# EasyEDA Pro project MN42_v2.eprj, schematic MOAR_Schematic

## Sheets
1 INTERFACE/LED/MIDI/CNTRL: Board Name: MOAR; Create Date: 2025-07-18; Page Name: INTERFACE/LED/MIDI/CNTRL; Project Name: MN42_v2; Schematic Name: MOAR_Schematic; Update Date: 2025-08-01; File: btnBRD; Id: /; Sheet: /
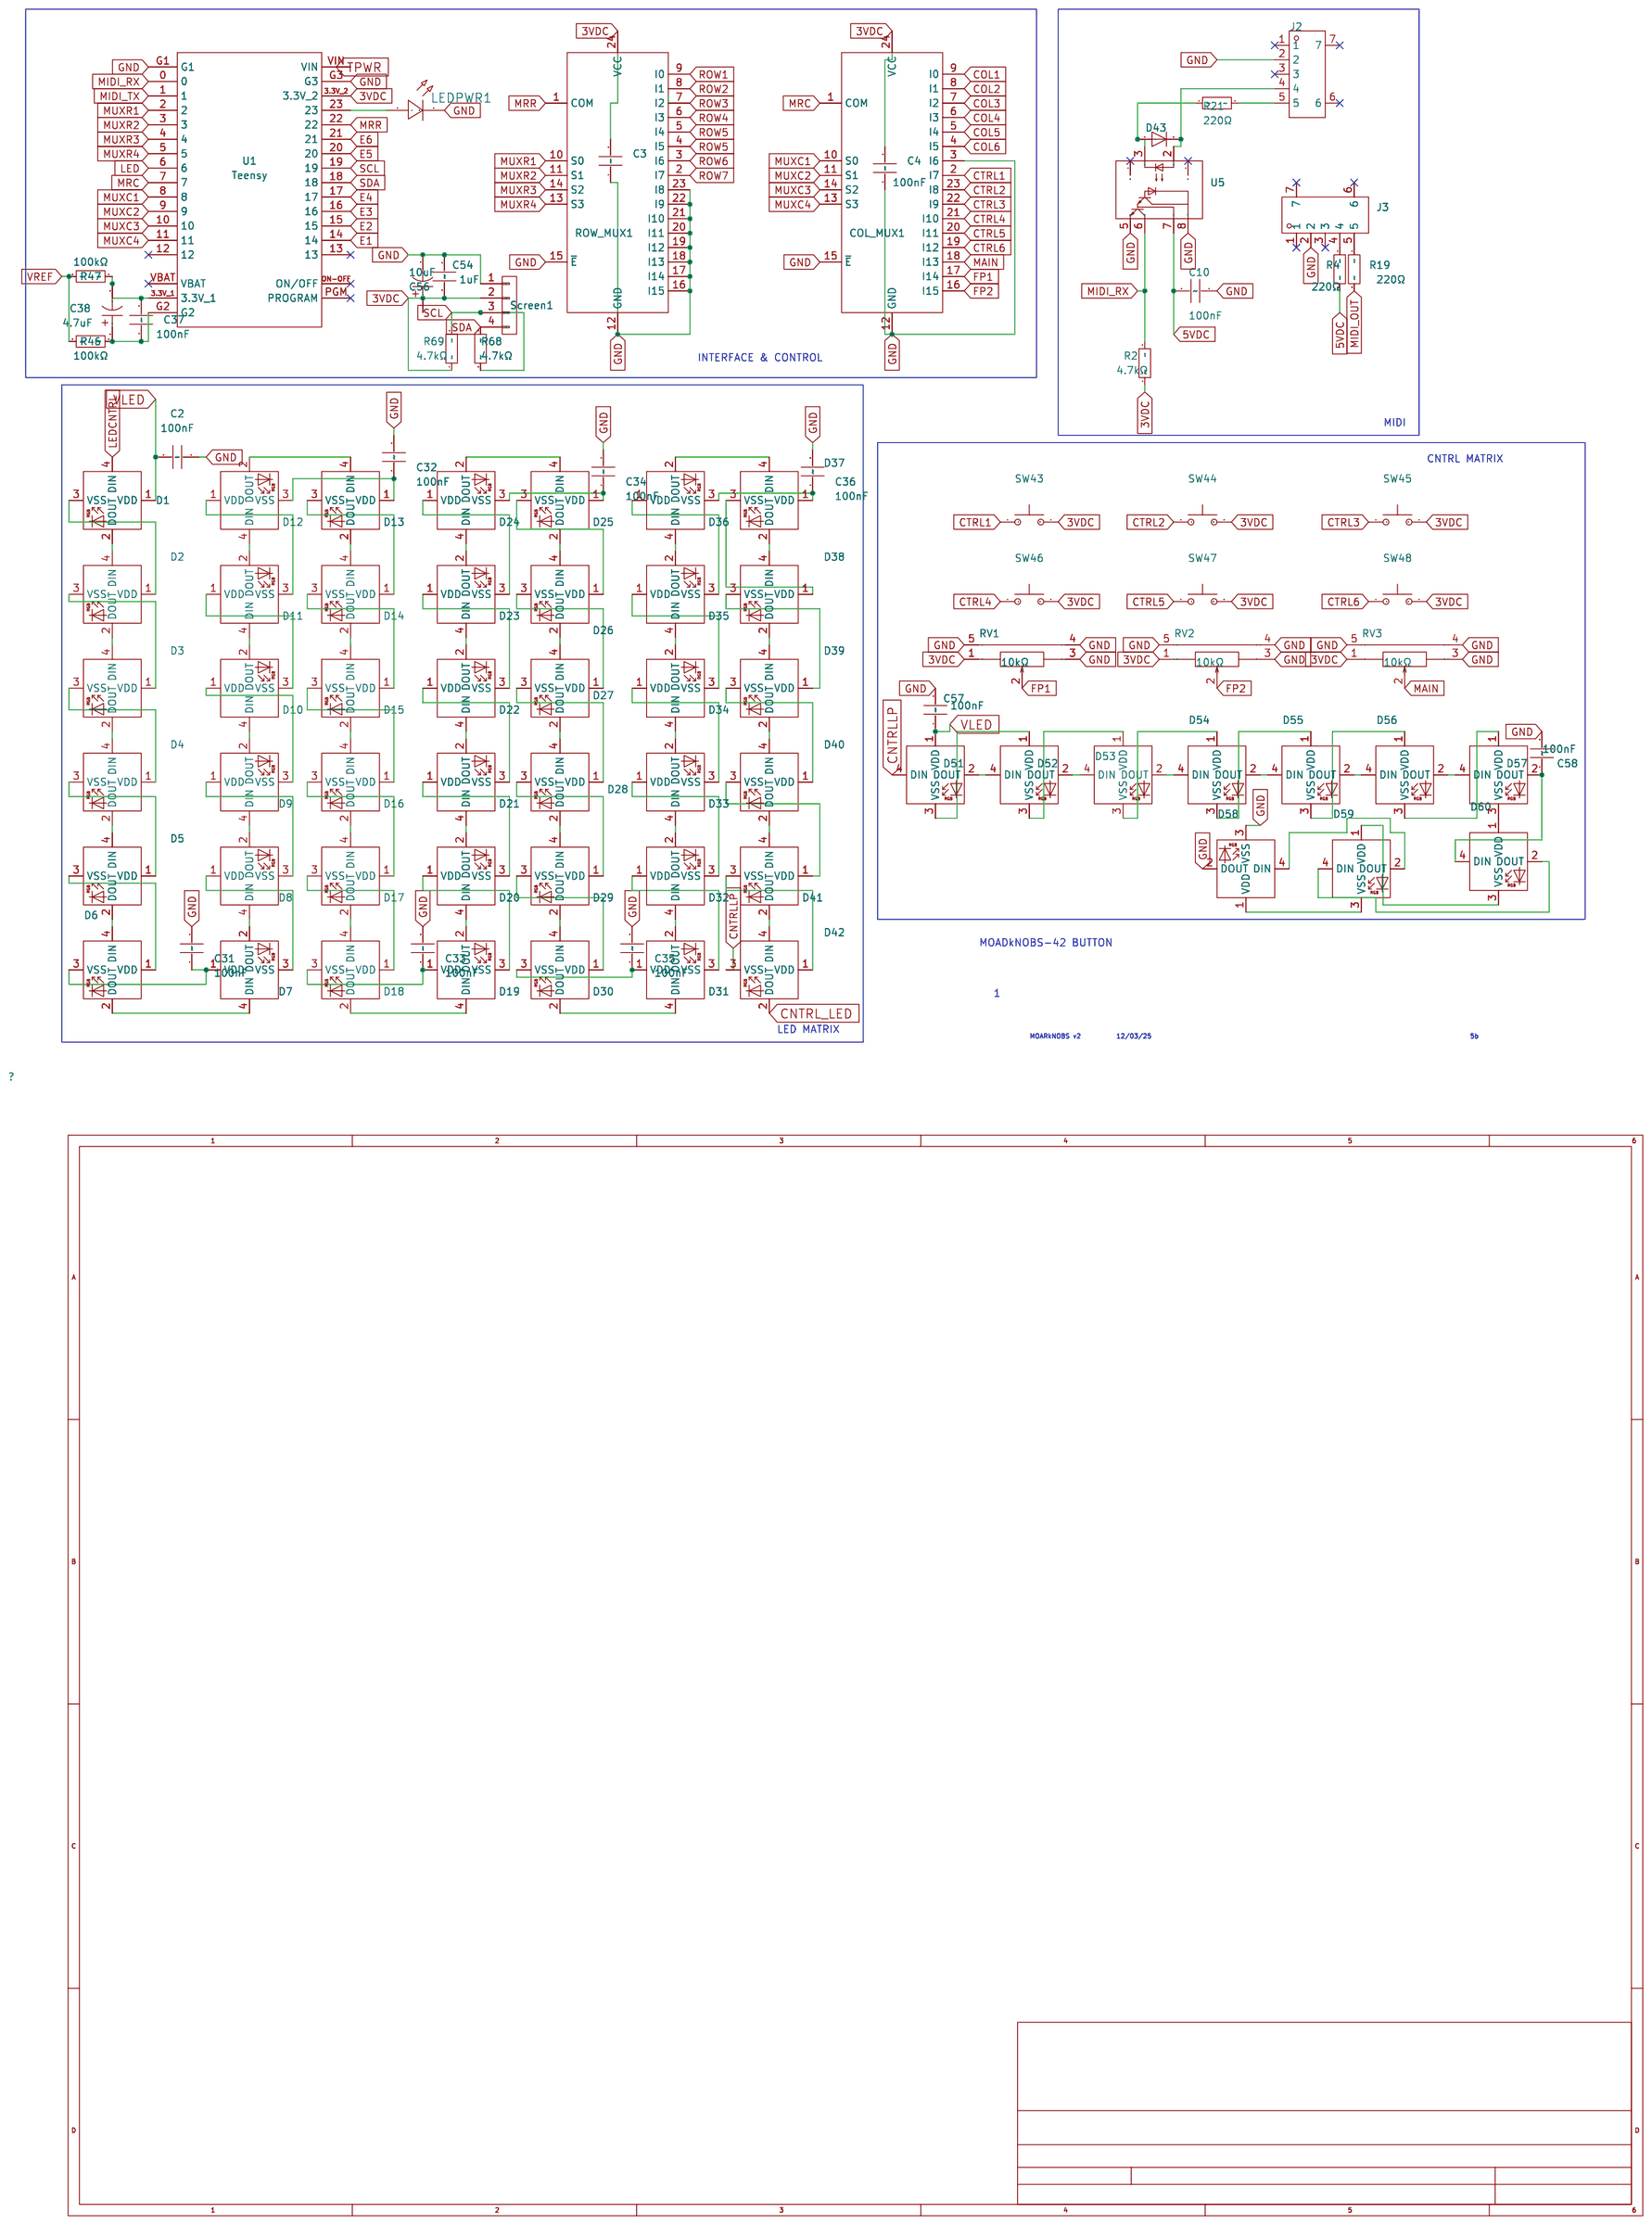
[diagram p0: INTERFACE/LED/MIDI/CNTRL]
2 ENVELOPE: Create Date: 2025-07-19; Page Name: ENVELOPE; Update Date: 2025-07-29; Company: EasyEDA.com; Page Size: A4; Version: V1.0
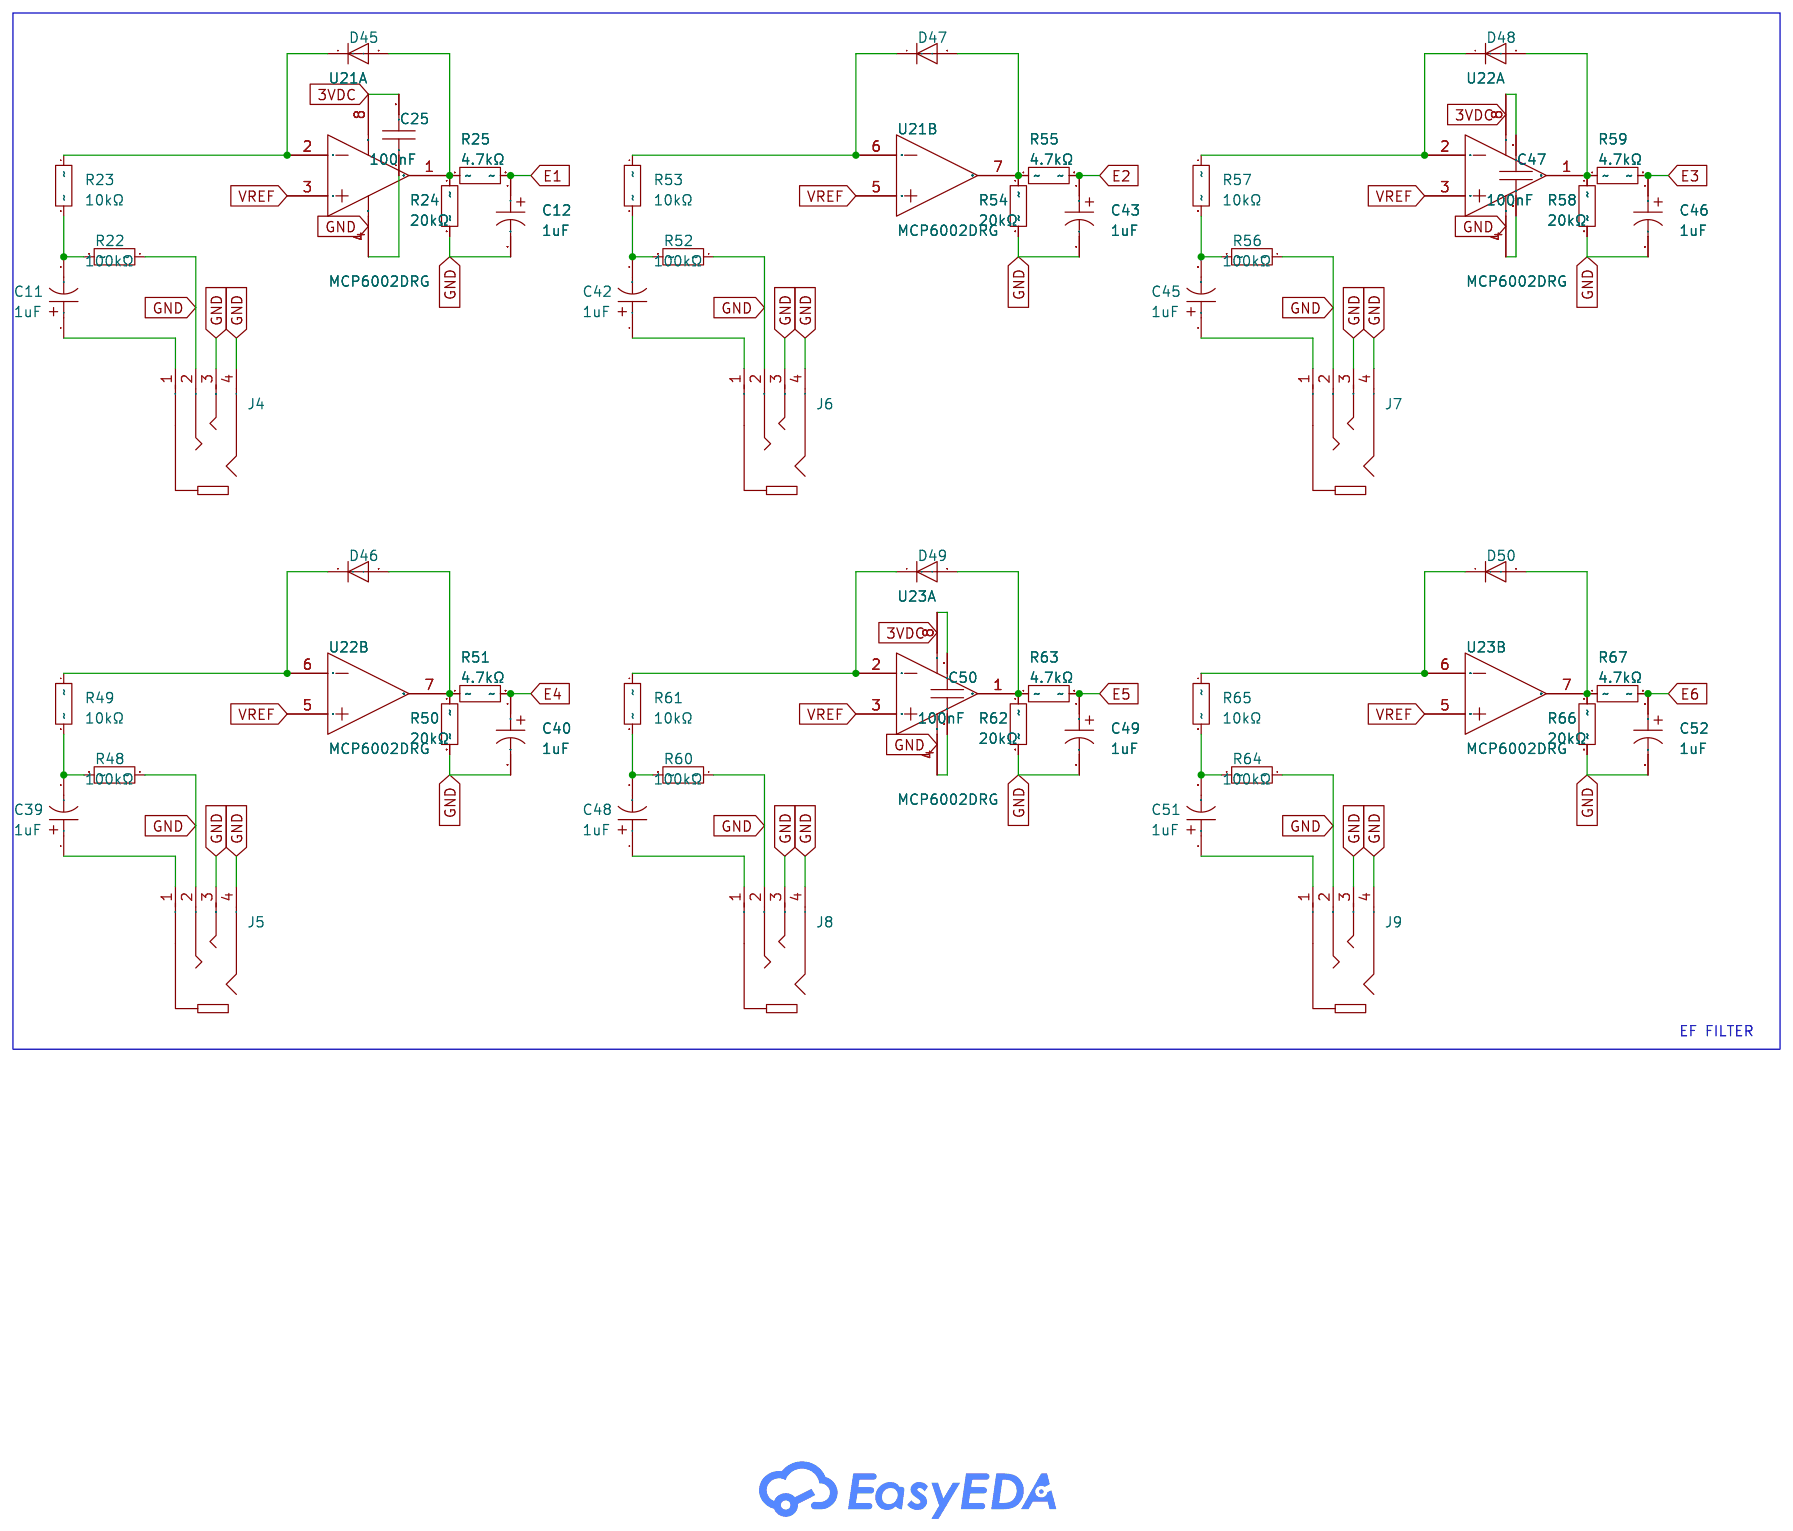
[diagram p1: ENVELOPE]
3 PWR/BUTTON/TEST: Board Name: btnBRD; Create Date: 2025-07-19; Page Name: P3; Schematic Name: btnBRD; Update Date: 2025-07-21; Company: EasyEDA.com; Page Size: A4; Version: V1.0
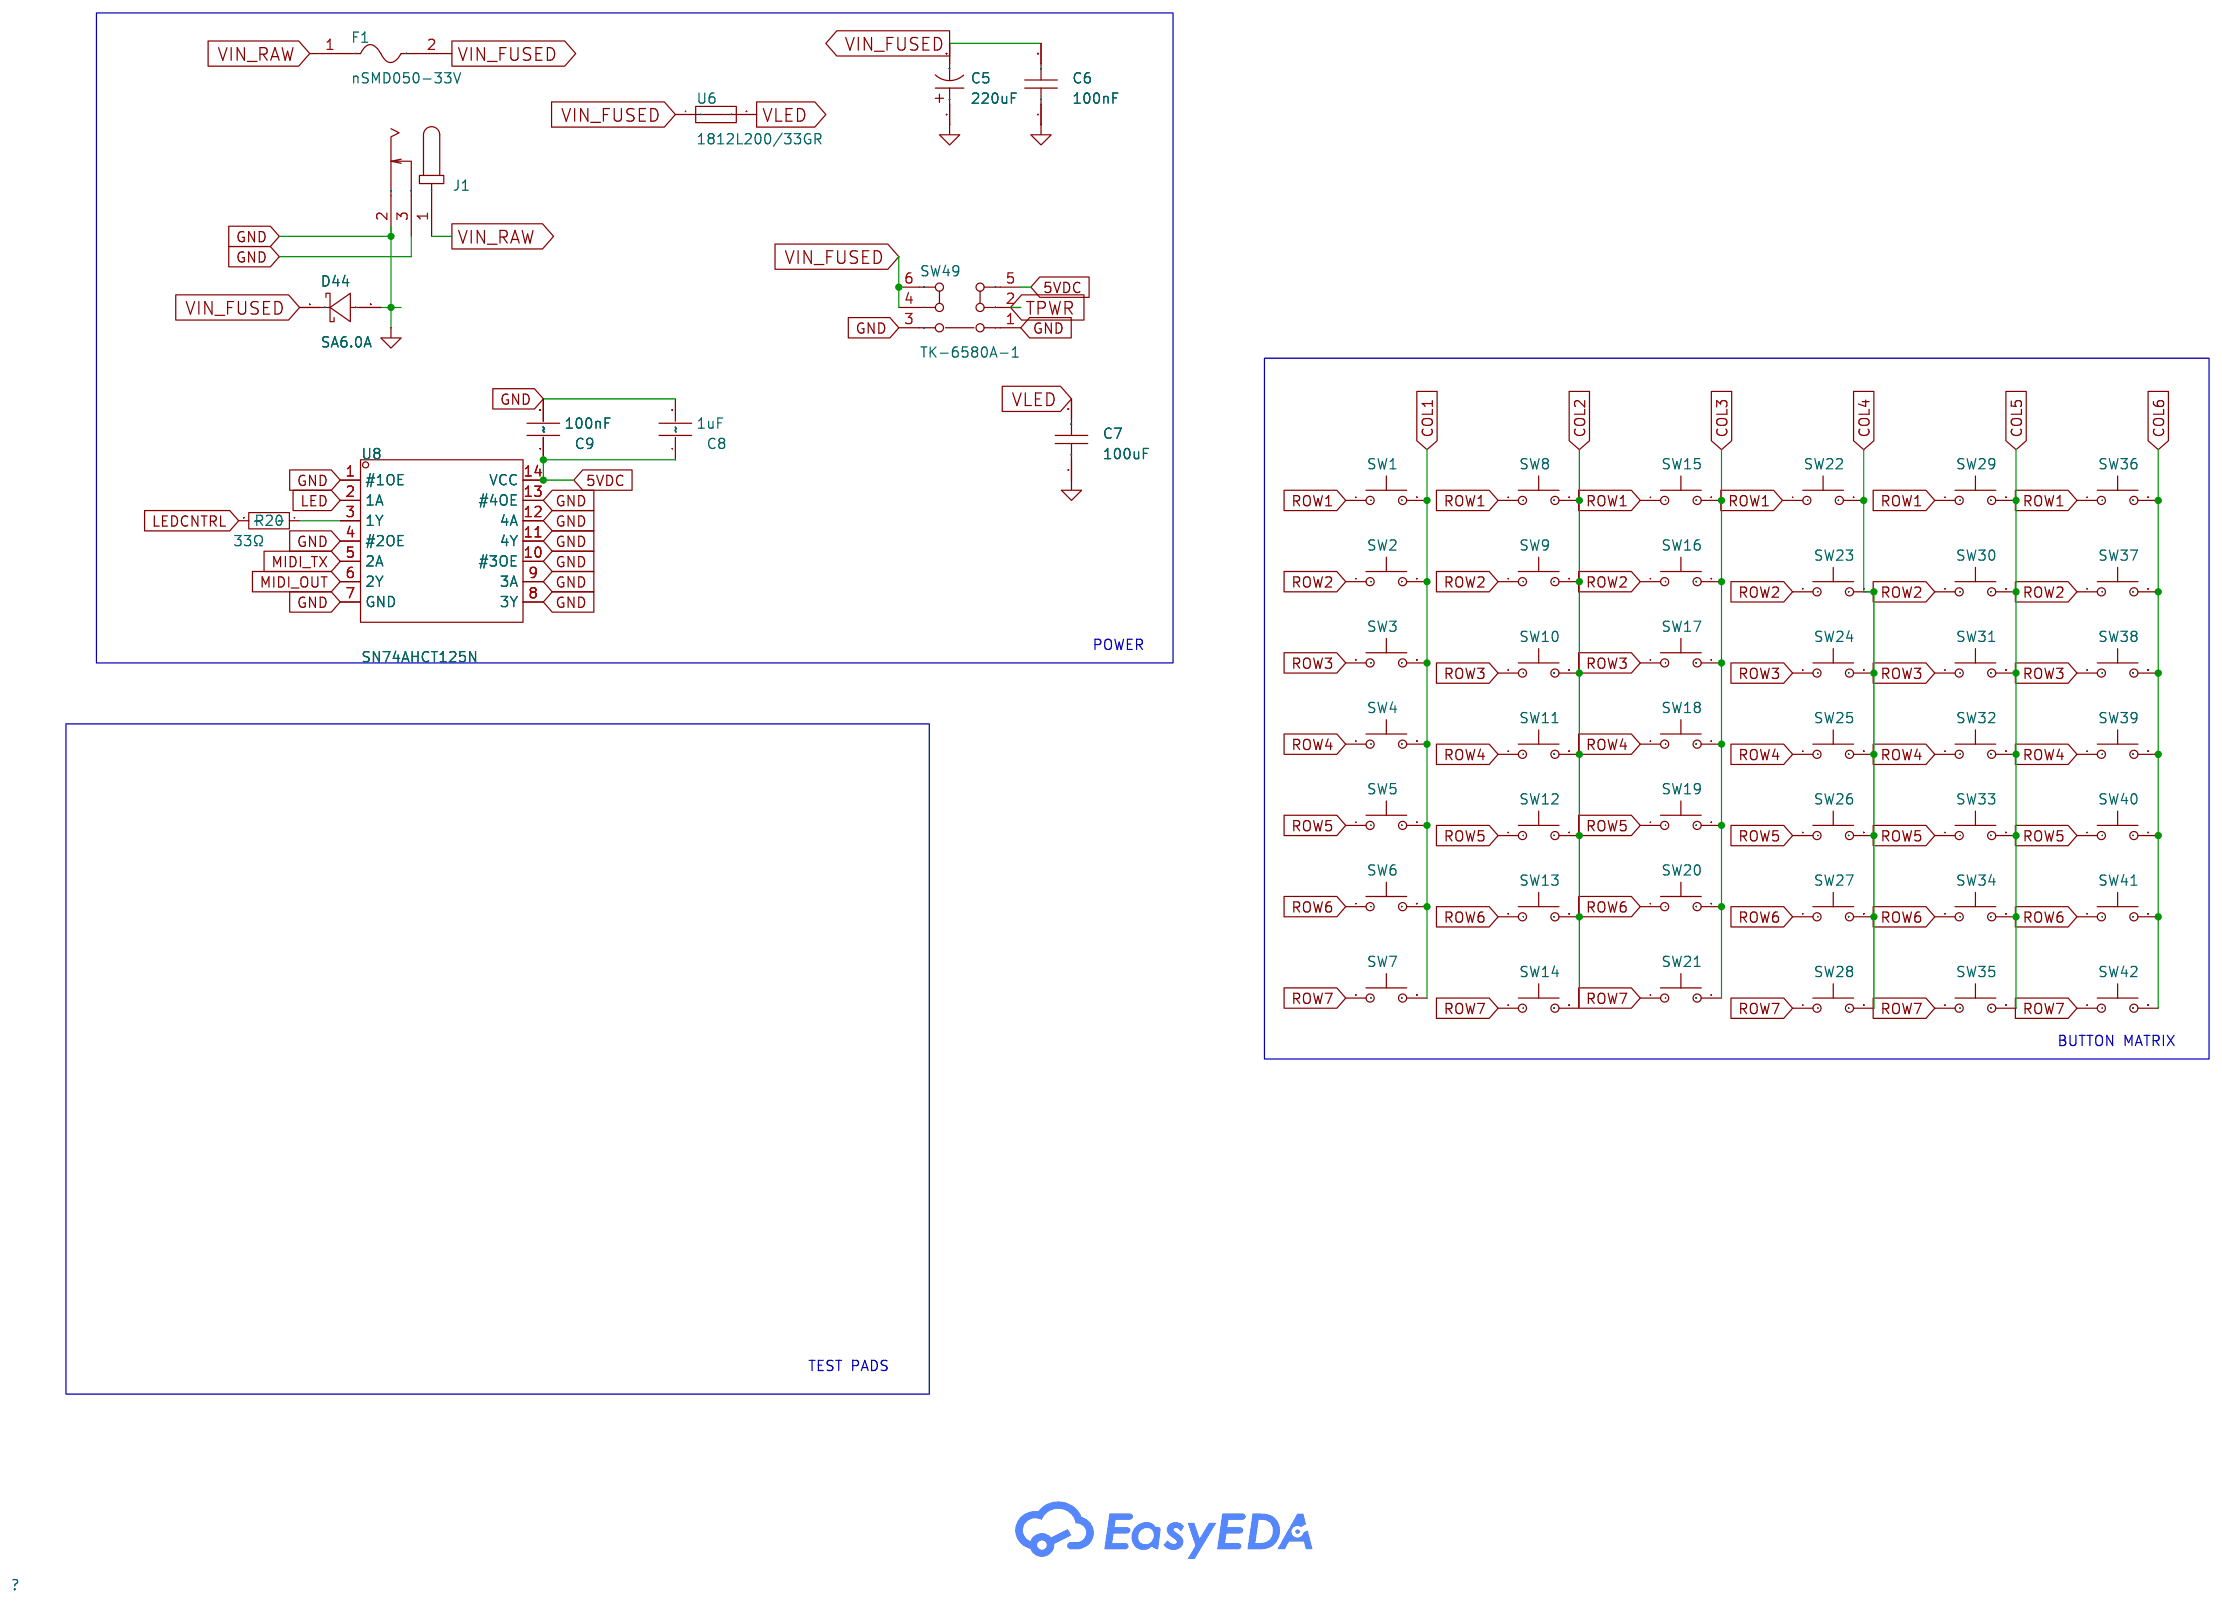
[diagram p2: PWR/BUTTON/TEST]

## Parts
sheet ENVELOPE
C11  1uF  [CAP-SMD_BD6.3-L6.6-W6.6-FD]
C12  1uF  [CAP-SMD_BD6.3-L6.6-W6.6-FD]
C25  100nF  [CAP-TH_L5.0-W2.5-P5.00-D1.0]
C39  1uF  [CAP-SMD_BD6.3-L6.6-W6.6-FD]
C40  1uF  [CAP-SMD_BD6.3-L6.6-W6.6-FD]
C42  1uF  [CAP-SMD_BD6.3-L6.6-W6.6-FD]
C43  1uF  [CAP-SMD_BD6.3-L6.6-W6.6-FD]
C45  1uF  [CAP-SMD_BD6.3-L6.6-W6.6-FD]
C46  1uF  [CAP-SMD_BD6.3-L6.6-W6.6-FD]
C47  100nF  [CAP-TH_L5.0-W2.5-P5.00-D1.0]
C48  1uF  [CAP-SMD_BD6.3-L6.6-W6.6-FD]
C49  1uF  [CAP-SMD_BD6.3-L6.6-W6.6-FD]
C50  100nF  [CAP-TH_L5.0-W2.5-P5.00-D1.0]
C51  1uF  [CAP-SMD_BD6.3-L6.6-W6.6-FD]
C52  1uF  [CAP-SMD_BD6.3-L6.6-W6.6-FD]
D45  1N4148PF  [DO-35_BD1.9-L3.9-P7.90-D0.5-FD]
D46  1N4148PF  [DO-35_BD1.9-L3.9-P7.90-D0.5-FD]
D47  1N4148PF  [DO-35_BD1.9-L3.9-P7.90-D0.5-FD]
D48  1N4148PF  [DO-35_BD1.9-L3.9-P7.90-D0.5-FD]
D49  1N4148PF  [DO-35_BD1.9-L3.9-P7.90-D0.5-FD]
D50  1N4148PF  [DO-35_BD1.9-L3.9-P7.90-D0.5-FD]
J4  HC-PJ-320A  [AUDIO-SMD_HC-PJ-320A]
J5  HC-PJ-320A  [AUDIO-SMD_HC-PJ-320A]
J6  HC-PJ-320A  [AUDIO-SMD_HC-PJ-320A]
J7  HC-PJ-320A  [AUDIO-SMD_HC-PJ-320A]
J8  HC-PJ-320A  [AUDIO-SMD_HC-PJ-320A]
J9  HC-PJ-320A  [AUDIO-SMD_HC-PJ-320A]
R22  100kΩ  [RES-TH_BD1.7-L3.5-P7.50-D0.5]
R23  10kΩ  [RES-TH_BD1.7-L3.5-P7.50-D0.5]
R24  20kΩ  [RES-TH_BD1.7-L3.5-P7.50-D0.5]
R25  4.7kΩ  [RES-TH_BD1.7-L3.5-P7.50-D0.5]
R48  100kΩ  [RES-TH_BD1.7-L3.5-P7.50-D0.5]
R49  10kΩ  [RES-TH_BD1.7-L3.5-P7.50-D0.5]
R50  20kΩ  [RES-TH_BD1.7-L3.5-P7.50-D0.5]
R51  4.7kΩ  [RES-TH_BD1.7-L3.5-P7.50-D0.5]
R52  100kΩ  [RES-TH_BD1.7-L3.5-P7.50-D0.5]
R53  10kΩ  [RES-TH_BD1.7-L3.5-P7.50-D0.5]
R54  20kΩ  [RES-TH_BD1.7-L3.5-P7.50-D0.5]
R55  4.7kΩ  [RES-TH_BD1.7-L3.5-P7.50-D0.5]
R56  100kΩ  [RES-TH_BD1.7-L3.5-P7.50-D0.5]
R57  10kΩ  [RES-TH_BD1.7-L3.5-P7.50-D0.5]
R58  20kΩ  [RES-TH_BD1.7-L3.5-P7.50-D0.5]
R59  4.7kΩ  [RES-TH_BD1.7-L3.5-P7.50-D0.5]
R60  100kΩ  [RES-TH_BD1.7-L3.5-P7.50-D0.5]
R61  10kΩ  [RES-TH_BD1.7-L3.5-P7.50-D0.5]
R62  20kΩ  [RES-TH_BD1.7-L3.5-P7.50-D0.5]
R63  4.7kΩ  [RES-TH_BD1.7-L3.5-P7.50-D0.5]
R64  100kΩ  [RES-TH_BD1.7-L3.5-P7.50-D0.5]
R65  10kΩ  [RES-TH_BD1.7-L3.5-P7.50-D0.5]
R66  20kΩ  [RES-TH_BD1.7-L3.5-P7.50-D0.5]
R67  4.7kΩ  [RES-TH_BD1.7-L3.5-P7.50-D0.5]
U21  MCP6002DRG  [SOP-8_L4.9-W3.9-P1.27-LS6.0-BL]  (sections 1,2)
U22  MCP6002DRG  [SOP-8_L4.9-W3.9-P1.27-LS6.0-BL]  (sections 1,2)
U23  MCP6002DRG  [SOP-8_L4.9-W3.9-P1.27-LS6.0-BL]  (sections 1,2)
sheet INTERFACE/LED/MIDI/CNTRL
C2  100nF  [CAP-TH_L5.0-W4.0-P5.00-D1.0]
C3  100nF  [CAP-TH_L5.0-W4.0-P5.00-D1.0]
C4  100nF  [CAP-TH_L5.0-W4.0-P5.00-D1.0]
C10  100nF  [CAP-TH_L5.0-W4.0-P5.00-D1.0]
C31  100nF  [CAP-TH_L5.0-W4.0-P5.00-D1.0]
C32  100nF  [CAP-TH_L5.0-W4.0-P5.00-D1.0]
C33  100nF  [CAP-TH_L5.0-W4.0-P5.00-D1.0]
C34  100nF  [CAP-TH_L5.0-W4.0-P5.00-D1.0]
C35  100nF  [CAP-TH_L5.0-W4.0-P5.00-D1.0]
C36  100nF  [CAP-TH_L5.0-W4.0-P5.00-D1.0]
C37  100nF  [CAP-TH_L5.0-W4.0-P5.00-D1.0]
C38  4.7uF  [CAP-SMD_BD6.3-L6.6-W6.6-FD]
C54  1uF  [CAP-TH_L5.0-W4.0-P5.00-D1.0]
C56  10uF  [CAP-SMD_BD6.3-L6.6-W6.6-FD]
C57  100nF  [CAP-TH_L5.0-W4.0-P5.00-D1.0]
C58  100nF  [CAP-TH_L5.0-W4.0-P5.00-D1.0]
COL_MUX1  CD74HC4067M96  [SOIC-24_L15.4-W7.5-P1.27-LS10.3-BL]
D1  XL-5050RGBC-WS2812B  [LED-SMD_4P-L5.0-W5.0-BL_XL-5050RGBC]
D2  XL-5050RGBC-WS2812B  [LED-SMD_4P-L5.0-W5.0-BL_XL-5050RGBC]
D3  XL-5050RGBC-WS2812B  [LED-SMD_4P-L5.0-W5.0-BL_XL-5050RGBC]
D4  XL-5050RGBC-WS2812B  [LED-SMD_4P-L5.0-W5.0-BL_XL-5050RGBC]
D5  XL-5050RGBC-WS2812B  [LED-SMD_4P-L5.0-W5.0-BL_XL-5050RGBC]
D6  XL-5050RGBC-WS2812B  [LED-SMD_4P-L5.0-W5.0-BL_XL-5050RGBC]
D7  XL-5050RGBC-WS2812B  [LED-SMD_4P-L5.0-W5.0-BL_XL-5050RGBC]
D8  XL-5050RGBC-WS2812B  [LED-SMD_4P-L5.0-W5.0-BL_XL-5050RGBC]
D9  XL-5050RGBC-WS2812B  [LED-SMD_4P-L5.0-W5.0-BL_XL-5050RGBC]
D10  XL-5050RGBC-WS2812B  [LED-SMD_4P-L5.0-W5.0-BL_XL-5050RGBC]
D11  XL-5050RGBC-WS2812B  [LED-SMD_4P-L5.0-W5.0-BL_XL-5050RGBC]
D12  XL-5050RGBC-WS2812B  [LED-SMD_4P-L5.0-W5.0-BL_XL-5050RGBC]
D13  XL-5050RGBC-WS2812B  [LED-SMD_4P-L5.0-W5.0-BL_XL-5050RGBC]
D14  XL-5050RGBC-WS2812B  [LED-SMD_4P-L5.0-W5.0-BL_XL-5050RGBC]
D15  XL-5050RGBC-WS2812B  [LED-SMD_4P-L5.0-W5.0-BL_XL-5050RGBC]
D16  XL-5050RGBC-WS2812B  [LED-SMD_4P-L5.0-W5.0-BL_XL-5050RGBC]
D17  XL-5050RGBC-WS2812B  [LED-SMD_4P-L5.0-W5.0-BL_XL-5050RGBC]
D18  XL-5050RGBC-WS2812B  [LED-SMD_4P-L5.0-W5.0-BL_XL-5050RGBC]
D19  XL-5050RGBC-WS2812B  [LED-SMD_4P-L5.0-W5.0-BL_XL-5050RGBC]
D20  XL-5050RGBC-WS2812B  [LED-SMD_4P-L5.0-W5.0-BL_XL-5050RGBC]
D21  XL-5050RGBC-WS2812B  [LED-SMD_4P-L5.0-W5.0-BL_XL-5050RGBC]
D22  XL-5050RGBC-WS2812B  [LED-SMD_4P-L5.0-W5.0-BL_XL-5050RGBC]
D23  XL-5050RGBC-WS2812B  [LED-SMD_4P-L5.0-W5.0-BL_XL-5050RGBC]
D24  XL-5050RGBC-WS2812B  [LED-SMD_4P-L5.0-W5.0-BL_XL-5050RGBC]
D25  XL-5050RGBC-WS2812B  [LED-SMD_4P-L5.0-W5.0-BL_XL-5050RGBC]
D26  XL-5050RGBC-WS2812B  [LED-SMD_4P-L5.0-W5.0-BL_XL-5050RGBC]
D27  XL-5050RGBC-WS2812B  [LED-SMD_4P-L5.0-W5.0-BL_XL-5050RGBC]
D28  XL-5050RGBC-WS2812B  [LED-SMD_4P-L5.0-W5.0-BL_XL-5050RGBC]
D29  XL-5050RGBC-WS2812B  [LED-SMD_4P-L5.0-W5.0-BL_XL-5050RGBC]
D30  XL-5050RGBC-WS2812B  [LED-SMD_4P-L5.0-W5.0-BL_XL-5050RGBC]
D31  XL-5050RGBC-WS2812B  [LED-SMD_4P-L5.0-W5.0-BL_XL-5050RGBC]
D32  XL-5050RGBC-WS2812B  [LED-SMD_4P-L5.0-W5.0-BL_XL-5050RGBC]
D33  XL-5050RGBC-WS2812B  [LED-SMD_4P-L5.0-W5.0-BL_XL-5050RGBC]
D34  XL-5050RGBC-WS2812B  [LED-SMD_4P-L5.0-W5.0-BL_XL-5050RGBC]
D35  XL-5050RGBC-WS2812B  [LED-SMD_4P-L5.0-W5.0-BL_XL-5050RGBC]
D36  XL-5050RGBC-WS2812B  [LED-SMD_4P-L5.0-W5.0-BL_XL-5050RGBC]
D37  XL-5050RGBC-WS2812B  [LED-SMD_4P-L5.0-W5.0-BL_XL-5050RGBC]
D38  XL-5050RGBC-WS2812B  [LED-SMD_4P-L5.0-W5.0-BL_XL-5050RGBC]
D39  XL-5050RGBC-WS2812B  [LED-SMD_4P-L5.0-W5.0-BL_XL-5050RGBC]
D40  XL-5050RGBC-WS2812B  [LED-SMD_4P-L5.0-W5.0-BL_XL-5050RGBC]
D41  XL-5050RGBC-WS2812B  [LED-SMD_4P-L5.0-W5.0-BL_XL-5050RGBC]
D42  XL-5050RGBC-WS2812B  [LED-SMD_4P-L5.0-W5.0-BL_XL-5050RGBC]
D43  1N4148PF  [DO-35_BD1.9-L3.9-P7.90-D0.5-FD]
D51  XL-5050RGBC-WS2812B  [LED-SMD_4P-L5.0-W5.0-BL_XL-5050RGBC]
D52  XL-5050RGBC-WS2812B  [LED-SMD_4P-L5.0-W5.0-BL_XL-5050RGBC]
D53  XL-5050RGBC-WS2812B  [LED-SMD_4P-L5.0-W5.0-BL_XL-5050RGBC]
D54  XL-5050RGBC-WS2812B  [LED-SMD_4P-L5.0-W5.0-BL_XL-5050RGBC]
D55  XL-5050RGBC-WS2812B  [LED-SMD_4P-L5.0-W5.0-BL_XL-5050RGBC]
D56  XL-5050RGBC-WS2812B  [LED-SMD_4P-L5.0-W5.0-BL_XL-5050RGBC]
D57  XL-5050RGBC-WS2812B  [LED-SMD_4P-L5.0-W5.0-BL_XL-5050RGBC]
D58  XL-5050RGBC-WS2812B  [LED-SMD_4P-L5.0-W5.0-BL_XL-5050RGBC]
D59  XL-5050RGBC-WS2812B  [LED-SMD_4P-L5.0-W5.0-BL_XL-5050RGBC]
D60  XL-5050RGBC-WS2812B  [LED-SMD_4P-L5.0-W5.0-BL_XL-5050RGBC]
J2  DIN-504B-M10  [CONN-TH_DIN-504B-M10]
J3  DIN-504B-M10  [CONN-TH_DIN-504B-M10]
LEDPWR1  -  [LED_0603]
R2  4.7kΩ  [RES-TH_BD1.7-L3.5-P7.50-D0.5]
R4  220Ω  [RES-TH_BD1.7-L3.5-P7.50-D0.5]
R19  220Ω  [RES-TH_BD1.7-L3.5-P7.50-D0.5]
R21  220Ω  [RES-TH_BD1.7-L3.5-P7.50-D0.5]
R46  100kΩ  [RES-TH_BD1.7-L3.5-P7.50-D0.5]
R47  100kΩ  [RES-TH_BD1.7-L3.5-P7.50-D0.5]
R68  4.7kΩ  [RES-TH_BD1.7-L3.5-P7.50-D0.5]
R69  4.7kΩ  [RES-TH_BD1.7-L3.5-P7.50-D0.5]
ROW_MUX1  CD74HC4067M96  [SOIC-24_L15.4-W7.5-P1.27-LS10.3-BL]
RV1  10kΩ  [RES-ADJ-TH_RK09K1130A5R]
RV2  10kΩ  [RES-ADJ-TH_RK09K1130A5R]
RV3  10kΩ  [RES-ADJ-TH_RK09K1130A5R]
Screen1  HS96L03W2C03  [OLED-TH_L27.8-W27.2-P2.54_C9900033791]
SW43  HX B3F-4055-Y  [SW-TH_4P-L12.0-W12.0-P5.00-LS12.5]
SW44  HX B3F-4055-Y  [SW-TH_4P-L12.0-W12.0-P5.00-LS12.5]
SW45  HX B3F-4055-Y  [SW-TH_4P-L12.0-W12.0-P5.00-LS12.5]
SW46  HX B3F-4055-Y  [SW-TH_4P-L12.0-W12.0-P5.00-LS12.5]
SW47  HX B3F-4055-Y  [SW-TH_4P-L12.0-W12.0-P5.00-LS12.5]
SW48  HX B3F-4055-Y  [SW-TH_4P-L12.0-W12.0-P5.00-LS12.5]
U1  Teensy  [teensy 4.0:MODULE_DEV-15583]
U5  6N138  [DIP-8_L9.8-W6.6-P2.54-LS7.6-BL]
sheet PWR/BUTTON/TEST
C5  220uF  [CAP-SMD_BD6.3-L6.6-W6.6-FD]
C6  100nF  [CAP-TH_L5.0-W2.5-P5.00-D1.0]
C7  100uF  [C1206]
C8  1uF  [CAP-TH_L5.0-W4.0-P5.00-D1.0]
C9  100nF  [CAP-TH_L5.0-W4.0-P5.00-D1.0]
D44  SA6.0A  [DO-15_BD3.1-L6.7-P10.70-D0.8-RD]
F1  nSMD050-33V  [F1206]
J1  DC005  [DC-IN-TH_DC005]
R20  33Ω  [RES-TH_BD1.7-L3.5-P7.50-D0.5]
SW1  HX B3F-4055-Y  [SW-TH_4P-L12.0-W12.0-P5.00-LS12.5]
SW2  HX B3F-4055-Y  [SW-TH_4P-L12.0-W12.0-P5.00-LS12.5]
SW3  HX B3F-4055-Y  [SW-TH_4P-L12.0-W12.0-P5.00-LS12.5]
SW4  HX B3F-4055-Y  [SW-TH_4P-L12.0-W12.0-P5.00-LS12.5]
SW5  HX B3F-4055-Y  [SW-TH_4P-L12.0-W12.0-P5.00-LS12.5]
SW6  HX B3F-4055-Y  [SW-TH_4P-L12.0-W12.0-P5.00-LS12.5]
SW7  HX B3F-4055-Y  [SW-TH_4P-L12.0-W12.0-P5.00-LS12.5]
SW8  HX B3F-4055-Y  [SW-TH_4P-L12.0-W12.0-P5.00-LS12.5]
SW9  HX B3F-4055-Y  [SW-TH_4P-L12.0-W12.0-P5.00-LS12.5]
SW10  HX B3F-4055-Y  [SW-TH_4P-L12.0-W12.0-P5.00-LS12.5]
SW11  HX B3F-4055-Y  [SW-TH_4P-L12.0-W12.0-P5.00-LS12.5]
SW12  HX B3F-4055-Y  [SW-TH_4P-L12.0-W12.0-P5.00-LS12.5]
SW13  HX B3F-4055-Y  [SW-TH_4P-L12.0-W12.0-P5.00-LS12.5]
SW14  HX B3F-4055-Y  [SW-TH_4P-L12.0-W12.0-P5.00-LS12.5]
SW15  HX B3F-4055-Y  [SW-TH_4P-L12.0-W12.0-P5.00-LS12.5]
SW16  HX B3F-4055-Y  [SW-TH_4P-L12.0-W12.0-P5.00-LS12.5]
SW17  HX B3F-4055-Y  [SW-TH_4P-L12.0-W12.0-P5.00-LS12.5]
SW18  HX B3F-4055-Y  [SW-TH_4P-L12.0-W12.0-P5.00-LS12.5]
SW19  HX B3F-4055-Y  [SW-TH_4P-L12.0-W12.0-P5.00-LS12.5]
SW20  HX B3F-4055-Y  [SW-TH_4P-L12.0-W12.0-P5.00-LS12.5]
SW21  HX B3F-4055-Y  [SW-TH_4P-L12.0-W12.0-P5.00-LS12.5]
SW22  HX B3F-4055-Y  [SW-TH_4P-L12.0-W12.0-P5.00-LS12.5]
SW23  HX B3F-4055-Y  [SW-TH_4P-L12.0-W12.0-P5.00-LS12.5]
SW24  HX B3F-4055-Y  [SW-TH_4P-L12.0-W12.0-P5.00-LS12.5]
SW25  HX B3F-4055-Y  [SW-TH_4P-L12.0-W12.0-P5.00-LS12.5]
SW26  HX B3F-4055-Y  [SW-TH_4P-L12.0-W12.0-P5.00-LS12.5]
SW27  HX B3F-4055-Y  [SW-TH_4P-L12.0-W12.0-P5.00-LS12.5]
SW28  HX B3F-4055-Y  [SW-TH_4P-L12.0-W12.0-P5.00-LS12.5]
SW29  HX B3F-4055-Y  [SW-TH_4P-L12.0-W12.0-P5.00-LS12.5]
SW30  HX B3F-4055-Y  [SW-TH_4P-L12.0-W12.0-P5.00-LS12.5]
SW31  HX B3F-4055-Y  [SW-TH_4P-L12.0-W12.0-P5.00-LS12.5]
SW32  HX B3F-4055-Y  [SW-TH_4P-L12.0-W12.0-P5.00-LS12.5]
SW33  HX B3F-4055-Y  [SW-TH_4P-L12.0-W12.0-P5.00-LS12.5]
SW34  HX B3F-4055-Y  [SW-TH_4P-L12.0-W12.0-P5.00-LS12.5]
SW35  HX B3F-4055-Y  [SW-TH_4P-L12.0-W12.0-P5.00-LS12.5]
SW36  HX B3F-4055-Y  [SW-TH_4P-L12.0-W12.0-P5.00-LS12.5]
SW37  HX B3F-4055-Y  [SW-TH_4P-L12.0-W12.0-P5.00-LS12.5]
SW38  HX B3F-4055-Y  [SW-TH_4P-L12.0-W12.0-P5.00-LS12.5]
SW39  HX B3F-4055-Y  [SW-TH_4P-L12.0-W12.0-P5.00-LS12.5]
SW40  HX B3F-4055-Y  [SW-TH_4P-L12.0-W12.0-P5.00-LS12.5]
SW41  HX B3F-4055-Y  [SW-TH_4P-L12.0-W12.0-P5.00-LS12.5]
SW42  HX B3F-4055-Y  [SW-TH_4P-L12.0-W12.0-P5.00-LS12.5]
SW49  TK-6580A-1  [SW-TH_TK-6580A-1]
U6  1812L200/33GR  [F1812]
U8  SN74AHCT125N  [PDIP-14_L19.3-W6.4-P2.54-LS7.6-BL]

## Library data of the parts
C5 C11 C12 C38-C40 C42 C43 C45 C46 C48 C49 C51 C52 C56 = 189RV0019: Capacitance:220uF Tolerance:±20% Tolerance:±20% Voltage Rating:35V Ripple Current:600mA@100KHz Equivalent Series Resistance(ESR):160mΩ@100KHz Diameter:6.3mm Height - Seated (Max):7.7mm Lifetime:2000hrs@105℃ Operating Temperature:-55℃~+105℃ Operating Tempe; LCSC Part Name: 220uF ±20% 35V; Supplier Part: C7471881; Manufacturer: KNSCHA(科尼盛); Supplier Footprint: SMD,D6.3xL7.7mm; JLCPCB Part Class: Extended Part; Datasheet: https://atta.szlcsc.com/upload/public/pdf/source/20230907/E1EFA38CB5E88857ECE494F7E9D8FBCC.pdf; Supplier: LCSC; Tolerance: ±20%; Voltage Rating: 35V; Ripple Current: 600mA@100KHz; Equivalent Series Resistance(ESR): 160mΩ@100KHz; Diameter: 6.3mm; Height - Seated (Max): 7.7mm; Lifetime: 2000hrs@105℃; Operating Temperature: -55℃~+105℃
C6 C25 C47 C50 = CC1H104MC1FD3F6C10MF: Capacitance:100nF Tolerance:±20% Tolerance:±20% Voltage Rating:50V Pin Spacing:5.08mm Temperature Coefficient:Y5V Diameter:6mm Body Thickness:2.2mm; LCSC Part Name: 100nF ±20% 50V; Supplier Part: C254085; Manufacturer: Dersonic(德尔创); Supplier Footprint: 插件,P=5.08mm; JLCPCB Part Class: Extended Part; Datasheet: https://atta.szlcsc.com/upload/public/pdf/source/20200826/C254085_159DD65BF32BF11C9168D341BCE23E6F.pdf; Supplier: LCSC; Tolerance: ±20%; Voltage Rating: 50V; Pin Spacing: 5.08mm; Temperature Coefficient: Y5V; Diameter: 6mm; Body Thickness: 2.2mm
D43 D45-D50 = 1N4148PF: Supplier Part: C2992430; Manufacturer: ST(先科); Supplier Footprint: DO-35; JLCPCB Part Class: Extended Part; Datasheet: https://atta.szlcsc.com/upload/public/pdf/source/20220414/133B43E450E13E2641A7D12D66654211.pdf; Supplier: LCSC
J4-J9 = HC-PJ-320A: Connector Type:3.5mm Headphone Jack Current Rating:500mA Voltage Rating (Max):30V Contact Material:Copper Contact Plating:Nickel Operating Temperature:-25℃~+70℃ Operating Temperature:-25℃~+70℃; LCSC Part Name: 黑色 3.5mm耳机座 PJ-320A 插件黑色; Supplier Part: C7501806; Manufacturer: HC(虹成电子); Supplier Footprint: 插件; JLCPCB Part Class: Extended Part; Datasheet: https://atta.szlcsc.com/upload/public/pdf/source/20250106/7D33987A36C8C755DD3F52F3C7FA5722.pdf; Supplier: LCSC; Connector Type: 3.5mm Headphone Jack; Current Rating: 500mA; Voltage Rating (Max): 30V; Contact Material: Copper; Contact Plating: Nickel; Operating Temperature: -25℃~+70℃
R2 R22-R25 R48-R69 = RN 1/8W 4K7 F T/B A1: Type:Metal Film Resistors Resistance: Tolerance:±1% Tolerance:±1% Overload Voltage (Max):150V Power(Watts):125mW Temperature Coefficient:±50ppm/℃ Temperature Coefficient:±50ppm/℃ Operating Temperature Range:-55℃~+125℃ Operating Temperature Range:-55℃~+125; LCSC Part Name: 4.7kΩ ±1% 125mW 金属膜电阻; Supplier Part: C433477; Manufacturer: Tyohm(幸亚电阻); Supplier Footprint: 插件,D1.7xL3.5mm; JLCPCB Part Class: Extended Part; Datasheet: https://atta.szlcsc.com/upload/public/pdf/source/20191008/C433681_B72693A7FD256E0D1DC5EFE3F095EED3.pdf; Supplier: LCSC; Type: Metal Film Resistors; Tolerance: ±1%; Overload Voltage (Max): 150V; Power(Watts): 125mW; Temperature Coefficient: ±50ppm/℃; Operating Temperature Range: -55℃~+125℃
U21-U23 = MCP6002DRG: LCSC Part Name: 带射频滤波器的1Mhz cmos轨到轨IO光放大器; Supplier Part: C5145244; Manufacturer: HGC(深圳汉芯); Supplier Footprint: SOP-8; JLCPCB Part Class: Extended Part; Datasheet: https://atta.szlcsc.com/upload/public/pdf/source/20240611/76E5A89C667E57E3492874B73CA75C44.pdf; Supplier: LCSC; Number of Circuits: Dual; Maximum Power Supply Range (Vdd-Vss): 6V; Rail to Rail: Rail-to-rail input, rail-to-rail output; Gain Bandwidth Product(GBP): 1MHz; Voltage - Input Offset(Vos): 3.5mV; Input Offset Voltage Drift (Vos TC): 2.7uV/℃; Slew Rate(SR): 0.8V/us; Noise density(eN): 20nV/√Hz@10kHz; Common Mode Rejection Ratio (CMRR): 68dB; Operating Temperature: -40℃~+125℃
C2-C4 C8-C10 C31-C37 C54 C57 C58 = CT4G-0805-2X1-63V-0.1μF-K: Capacitance:100nF Tolerance:±10% Tolerance:±10% Voltage Rating:63V Temperature Coefficient:-; LCSC Part Name: 100nF ±10% 63V; Supplier Part: C400087; Manufacturer: TORCH(火炬); Supplier Footprint: 插件,P=5.08mm; JLCPCB Part Class: Extended Part; Datasheet: https://atta.szlcsc.com/upload/public/pdf/source/20191118/C454433_59D9A4E5EF49F2CA9CCAEF3FF757A9ED.pdf; Supplier: LCSC; Tolerance: ±10%; Voltage Rating: 63V
COL_MUX1 ROW_MUX1 = CD74HC4067M96: Switch Circuit:- Number of Channels:16 Supply Voltage:2V~6V Supply Voltage:2V~6V Turn-on time:83ns On-State Resistance (Max):200Ω Turn-off time:83ns Operating Temperature:-55℃~+125℃ Operating Temperature:-55℃~+125℃; LCSC Part Name: 高速CMOS逻辑16通道模拟多路复用器/解复用器; Supplier Part: C496123; Manufacturer: TI(德州仪器); Supplier Footprint: SOIC-24-300mil; JLCPCB Part Class: Extended Part; Datasheet: https://www.ti.com/cn/lit/gpn/cd74hc4067; Supplier: LCSC; Number of Channels: 16; Supply Voltage: 2V~6V; Turn-on time: 83ns; On-State Resistance (Max): 200Ω; Turn-off time: 83ns; Operating Temperature: -55℃~+125℃
D1-D42 D51-D60 = XL-5050RGBC-WS2812B: Supplier Part: C2843785; Manufacturer: XINGLIGHT(成兴光); Supplier Footprint: SMD5050; JLCPCB Part Class: Extended Part; Datasheet: https://atta.szlcsc.com/upload/public/pdf/source/20240412/E1004CAA80592E31D08BFE019083806F.pdf; Supplier: LCSC
J2 J3 = DIN-504B-M10: Supplier Part: C2939346; Manufacturer: HOOYA(皓宇电子); Supplier Footprint: 插件; JLCPCB Part Class: Extended Part; Datasheet: https://atta.szlcsc.com/upload/public/pdf/source/20220120/ABB2570656C6359DBC61E5C1017AC323.pdf; Supplier: LCSC
LEDPWR1 = LED_0603-R: Supplier Footprint: 0603
R4 R19 R21 = RN 1/8W 220R F T/B A1: Type:Metal Film Resistors Resistance: Tolerance:±1% Tolerance:±1% Overload Voltage (Max):150V Power(Watts):125mW Temperature Coefficient:±50ppm/℃ Temperature Coefficient:±50ppm/℃ Operating Temperature Range:-55℃~+125℃ Operating Temperature Range:-55℃~+125; LCSC Part Name: 220Ω ±1% 125mW 金属膜电阻; Supplier Part: C433487; Manufacturer: Tyohm(幸亚电阻); Supplier Footprint: 插件,D1.7xL3.5mm; JLCPCB Part Class: Extended Part; Datasheet: https://atta.szlcsc.com/upload/public/pdf/source/20191008/C433681_B72693A7FD256E0D1DC5EFE3F095EED3.pdf; Supplier: LCSC; Type: Metal Film Resistors; Tolerance: ±1%; Overload Voltage (Max): 150V; Power(Watts): 125mW; Temperature Coefficient: ±50ppm/℃; Operating Temperature Range: -55℃~+125℃
R20 R46 R47 = RN1/8W10KFT/BA1: Type:Metal Film Resistors Resistance: Tolerance:±1% Tolerance:±1% Overload Voltage (Max):150V Power(Watts):125mW Temperature Coefficient:±50ppm/℃ Temperature Coefficient:±50ppm/℃ Operating Temperature Range:-55℃~+125℃ Operating Temperature Range:-55℃~+125; LCSC Part Name: 10kΩ ±1% 125mW 金属膜电阻; Supplier Part: C433502; Manufacturer: Tyohm(幸亚电阻); Supplier Footprint: 插件,D1.7xL3.5mm; JLCPCB Part Class: Extended Part; Datasheet: https://atta.szlcsc.com/upload/public/pdf/source/20191008/C433681_B72693A7FD256E0D1DC5EFE3F095EED3.pdf; Supplier: LCSC; Type: Metal Film Resistors; Tolerance: ±1%; Overload Voltage (Max): 150V; Power(Watts): 125mW; Temperature Coefficient: ±50ppm/℃; Operating Temperature Range: -55℃~+125℃
RV1-RV3 = RK09K1130A5R: Resistance: Tolerance:±20% Tolerance:±20%; LCSC Part Name: 10kΩ ±20%; Supplier Part: C209779; Manufacturer: ALPSALPINE(阿尔卑斯阿尔派); Supplier Footprint: 插件; JLCPCB Part Class: Extended Part; Datasheet: https://atta.szlcsc.com/upload/public/pdf/source/20180404/C209779_144B5EF41D1B8507FF4660D0445AF581.pdf; Supplier: LCSC; Tolerance: ±20%
Screen1 = HS96L03W2C03: Main Control Chip:SSD1315 Interface Type:I2C Size:0.96 Pixel Resolution:128x64 Operating Temperature:-40℃~+70℃ Operating Temperature:-40℃~+70℃; LCSC Part Name: 0.96寸OLED显示屏窄白光IIC; Supplier Part: C5248080; Manufacturer: HS(汉昇); JLCPCB Part Class: Extended Part; Datasheet: https://atta.szlcsc.com/upload/public/pdf/source/20230627/763D01F79A90007632F098068C7C8AD9.pdf; Supplier: LCSC; Main Control Chip: SSD1315; Interface Type: I2C; Size: 0.96; Pixel Resolution: 128x64; Operating Temperature: -40℃~+70℃
SW1-SW48 = HX B3F-4055-Y: Actuator Style:Square Plunger Operating Force:2.5N Mounting Type:Direct Insert Length:11.8mm Width:11.8mm Switch Height:7.3mm Strike Gundam:- Contact Current:50mA Voltage Rating:12V Actuator/Cap Color:Yellow With Lamp:None IP Rating:- Termination Style:PC; LCSC Part Name: 12*12*7.3mm 直插 轻触开关; Supplier Part: C36498965; Manufacturer: hanxia(韩下); Supplier Footprint: DIP,12x12mm; JLCPCB Part Class: Extended Part; Datasheet: https://atta.szlcsc.com/upload/public/pdf/source/20241121/FA8A3B5FC41001412F2E47168C08B6C2.pdf; Supplier: LCSC; Actuator Style: Square Plunger; Operating Force: 2.5N; Mounting Type: Direct Insert; Length: 11.8mm; Width: 11.8mm; Switch Height: 7.3mm; Contact Current: 50mA; Voltage Rating: 12V; Actuator/Cap Color: Yellow; With Lamp: None; Termination Style: PCPin; Life: 100,000 Times; Operating Temperature: -25℃~+85℃
U1 = teensy40_DEV-15583: STANDARD: Manufacturer Recommendations; MAXIMUM_PACKAGE_HEIGHT: 5.87mm; MANUFACTURER: Sparkfun
U5 = 6N138: Input Type:DC Supply Voltage:- Supply Voltage:- Isolation Voltage(rms):5kV Common Mode Transient Immunity (CMTI):1kV/us Number of Channels:1 Operating Temperature:-55℃~+85℃ Operating Temperature:-55℃~+85℃; LCSC Part Name: DC输入 1通道 隔离电压(rms):5000V; Supplier Part: C255743; Manufacturer: ISOCOM(英国安数光); Supplier Footprint: DIP-8; JLCPCB Part Class: Extended Part; Datasheet: https://atta.szlcsc.com/upload/public/pdf/source/20180822/C255747_0DE46B44EFBF5BF2F7E9C825E24779A2.pdf; Supplier: LCSC; Input Type: DC; Isolation Voltage(rms): 5kV; Common Mode Transient Immunity (CMTI): 1kV/us; Number of Channels: 1; Operating Temperature: -55℃~+85℃
C7 = HGC1206R5107M100NSPJ: Capacitance:100uF Tolerance:±20% Tolerance:±20% Voltage Rating:10V Temperature Coefficient:X5R; LCSC Part Name: 100uF ±20% 10V; Supplier Part: C7432784; Manufacturer: Chinocera(华瓷); Supplier Footprint: 1206; JLCPCB Part Class: Extended Part; Datasheet: https://atta.szlcsc.com/upload/public/pdf/source/20240320/FAC3FEC40A78BC5CCCE96C232A94D860.pdf; Supplier: LCSC; Tolerance: ±20%; Voltage Rating: 10V; Temperature Coefficient: X5R
D44 = SA6.0A: Reverse Stand-Off Voltage (Vrwm):6V Maximum Clamping Voltage:10.3V Peak Pulse Current (Ipp)@10/1000us:49.5A Peak Pulse Power Dissipation (Ppp)@10/1000us:500W Breakdown Voltage:6.67V Type:TVS; LCSC Part Name: TVS 6V截止 49.5A峰值脉冲; Supplier Part: C1973281; Manufacturer: Littelfuse(美国力特); Supplier Footprint: DO-15(DO-204AC); JLCPCB Part Class: Extended Part; Datasheet: https://atta.szlcsc.com/upload/public/pdf/source/20210601/0B3E4F854A384945BCD9F467CEEB89B0.pdf; Supplier: LCSC; Reverse Stand-Off Voltage (Vrwm): 6V; Maximum Clamping Voltage: 10.3V; Peak Pulse Current (Ipp)@10/1000us: 49.5A; Peak Pulse Power Dissipation (Ppp)@10/1000us: 500W; Breakdown Voltage: 6.67V; Type: TVS
F1 = nSMD050-33V: Voltage - Max:33V Current - Max:100A Hold Current:500mA Trip Current:1A; LCSC Part Name: 0.50A  33V 自恢复保险丝; Supplier Part: C70077; Manufacturer: 台湾陆海; Supplier Footprint: 1206; JLCPCB Part Class: Extended Part; Datasheet: https://atta.szlcsc.com/upload/public/pdf/source/20180608/C70077_B8D50CC58F6AC16481F48F7D0521DF66.pdf; Supplier: LCSC; Voltage - Max: 33V; Current - Max: 100A; Hold Current: 500mA; Trip Current: 1A
J1 = DC005: Connector Type:DC Power Receptacle Mounting Style:Bend-in Inside Contact Diameter:2mm Outside Contact Diameter:6.3mm Current Rating (Max):500mA Voltage Rating (Max):30V Operating Temperature Range:-25℃~+70℃ Operating Temperature Range:-25℃~+70℃; LCSC Part Name: DC电源插座 内径:2mm 外径:6.3mm; Supplier Part: C431533; Manufacturer: SHOU HAN(首韩); Supplier Footprint: 插件; JLCPCB Part Class: Extended Part; Datasheet: https://atta.szlcsc.com/upload/public/pdf/source/20190925/C431533_4751811035784AC1D38EBC85F7905E99.pdf; Supplier: LCSC; Connector Type: DC Power Receptacle; Mounting Style: Bend-in; Inside Contact Diameter: 2mm; Outside Contact Diameter: 6.3mm; Current Rating (Max): 500mA; Voltage Rating (Max): 30V; Operating Temperature Range: -25℃~+70℃
SW49 = TK-6580A-1: Circuit:DPDT Self Lock / No Lock:LATCHING Actuator Style:Projected Plunger Mounting Style:Lying Actuator/Cap Color:White Pin Style:PCPin Operating Force:250gf Mechanical Life:-; LCSC Part Name: 自锁开关5.8*5.8*9.9有声有锁插件六脚DIP按键开关带锁6P脚; Supplier Part: C528770; Manufacturer: Yuandi(元迪); Supplier Footprint: 插件; JLCPCB Part Class: Extended Part; Datasheet: https://atta.szlcsc.com/upload/public/pdf/source/20200831/C528770_3D9C55C6A36B9A979586F85D435EB40C.pdf; Supplier: LCSC; Circuit: DPDT; Self Lock / No Lock: LATCHING; Actuator Style: Projected Plunger; Mounting Style: Lying; Actuator/Cap Color: White; Pin Style: PCPin; Operating Force: 250gf
U6 = 1812L200/33GR: Operating Voltage (Max):33V Current Rating (Max):40A Hold Current:2A Trip Current:4A Power Dissipation:1.4W Resistance - Initial (Ri) (Min):20mΩ Resistance - Post Trip (R1) (Max):100mΩ Maximum Time to Trip:2s Operating Temperature:-40℃~+85℃ Operating Temp; LCSC Part Name: 33V 2A 自恢复保险丝; Supplier Part: C18198343; Manufacturer: LUTE(陆特); Supplier Footprint: 1812; JLCPCB Part Class: Extended Part; Datasheet: https://atta.szlcsc.com/upload/public/pdf/source/20230926/57461D6230B1C3E982BE957E074F147E.pdf; Supplier: LCSC; Operating Voltage (Max): 33V; Current Rating (Max): 40A; Hold Current: 2A; Trip Current: 4A; Power Dissipation: 1.4W; Resistance - Initial (Ri) (Min): 20mΩ; Resistance - Post Trip (R1) (Max): 100mΩ; Maximum Time to Trip: 2s; Operating Temperature: -40℃~+85℃
U8 = SN74AHCT125N: output type:Tri-State Voltage - Supply:4.5V~5.5V Voltage - Supply:4.5V~5.5V Number of Elements:4 Number of Bits per Element:1 Current - Output Low(IOL):8mA Current - Output High(IOH):8mA Logic Family:74AHCT Operating Temperature:-40℃~+85℃ Operating Temper; Supplier Part: C354152; Manufacturer: TI(德州仪器); Supplier Footprint: DIP-14; JLCPCB Part Class: Extended Part; Datasheet: https://www.ti.com/cn/lit/gpn/sn74ahct125; Supplier: LCSC; output type: Tri-State; Voltage - Supply: 4.5V~5.5V; Number of Elements: 4; Number of Bits per Element: 1; Current - Output Low(IOL): 8mA; Current - Output High(IOH): 8mA; Logic Family: 74AHCT; Operating Temperature: -40℃~+85℃

## Nets
3VDC: C3.2 C4.2 C25.2 C54.1 C56.1 COL_MUX1.24(VCC) R2.1 R69.1 ROW_MUX1.24(VCC) RV1.1 RV2.1 RV3.1 Screen1.2(Pin) SW43.2 SW44.2 SW45.2 SW46.2 SW47.2 SW48.2 U1.3.3V_2 U21.8(VDD)
5VDC: C8.1 C9.1 C10.2 R4.2 SW49.5 U5.7(VO1) U8.14(VCC)
GND: C2.2 C3.1 C4.1 C5.1 C6.1 C7.1 C8.2 C9.2 C10.1 C12.2 C31.2 C32.2 C33.2 C34.2 C35.2 C36.2 C40.2 C43.2 C46.2 C49.2 C52.2 C54.2 C56.2 C57.2 C58.2 COL_MUX1.3(I6) COL_MUX1.12(GND) COL_MUX1.15(~{E}) D44.2(A) D58.2(DOUT) D58.3(VSS) J1.2 J1.3 J2.2 J3.2 J4.2 J4.3 J4.4 J5.2 J5.3 J5.4 J6.2 J6.3 J6.4 J7.2 J7.3 J7.4 J8.2 J8.3 J8.4 J9.2 J9.3 J9.4 LEDPWR1.1(C) R22.1 R24.2 R48.1 R50.2 R52.1 R54.2 R56.1 R58.2 R60.1 R62.2 R64.1 R66.2 ROW_MUX1.12(GND) ROW_MUX1.15(~{E}) ROW_MUX1.16(I15) ROW_MUX1.17(I14) ROW_MUX1.18(I13) ROW_MUX1.19(I12) ROW_MUX1.20(I11) ROW_MUX1.21(I10) ROW_MUX1.22(I9) ROW_MUX1.23(I8) RV1.3 RV1.4(EH) RV1.5(EH) RV2.3 RV2.4(EH) RV2.5(EH) RV3.3 RV3.4(EH) RV3.5(EH) Screen1.1(Pin) SW49.1 SW49.3 U1.G1 U1.G3 U5.5(GND) U5.8(VCC) U8.1(#1OE) U8.4(#2OE) U8.7(GND) U8.8(3Y) U8.9(3A) U8.10(#3OE) U8.11(4Y) U8.12(4A) U8.13(#4OE)
VIN_FUSED: C5.2 C6.2 D44.1(K) F1.2 SW49.4 SW49.6 U6.1
VIN_RAW: F1.1 J1.1
CNTRL_LED: D42.2(DOUT)
CNTRLLP: D42.3(VSS) D51.4(DIN)
COL1: COL_MUX1.9(I0) SW1.2 SW2.2 SW3.2 SW4.2 SW5.2 SW6.2 SW7.2
COL2: COL_MUX1.8(I1) SW8.2 SW9.2 SW10.2 SW11.2 SW12.2 SW13.2 SW14.2
COL3: COL_MUX1.7(I2) SW15.2 SW16.2 SW17.2 SW18.2 SW19.2 SW20.2 SW21.2
COL4: COL_MUX1.6(I3) SW22.2 SW23.2 SW24.2 SW25.2 SW26.2 SW27.2 SW28.2
COL5: COL_MUX1.5(I4) SW29.2 SW30.2 SW31.2 SW32.2 SW33.2 SW34.2 SW35.2
COL6: COL_MUX1.4(I5) SW36.2 SW37.2 SW38.2 SW39.2 SW40.2 SW41.2 SW42.2
CTRL1: COL_MUX1.2(I7) SW43.1
CTRL2: COL_MUX1.23(I8) SW44.1
CTRL3: COL_MUX1.22(I9) SW45.1
CTRL4: COL_MUX1.21(I10) SW46.1
CTRL5: COL_MUX1.20(I11) SW47.1
CTRL6: COL_MUX1.19(I12) SW48.1
E1: C12.1 R25.2 U1.14
E2: C43.1 R55.2 U1.15
E3: C46.1 R59.2 U1.16
E4: C40.1 R51.2 U1.17
E5: C49.1 R63.2 U1.20
E6: C52.1 R67.2 U1.21
FP1: COL_MUX1.17(I14) RV1.2
FP2: COL_MUX1.16(I15) RV2.2
LED: U1.6 U8.2(1A)
LEDCNTRL: D1.4(DIN) R20.2
MAIN: COL_MUX1.18(I13) RV3.2
MIDI_OUT: R19.2 U8.6(2Y)
MIDI_RX: R2.2 U1.0 U5.6(VO2)
MIDI_TX: U1.1 U8.5(2A)
MRC: COL_MUX1.1(COM) U1.7
MRR: ROW_MUX1.1(COM) U1.22
MUXC1: COL_MUX1.10(S0) U1.8
MUXC2: COL_MUX1.11(S1) U1.9
MUXC3: COL_MUX1.14(S2) U1.10
MUXC4: COL_MUX1.13(S3) U1.11
MUXR1: ROW_MUX1.10(S0) U1.2
MUXR2: ROW_MUX1.11(S1) U1.3
MUXR3: ROW_MUX1.14(S2) U1.4
MUXR4: ROW_MUX1.13(S3) U1.5
ROW1: ROW_MUX1.9(I0) SW1.1 SW8.1 SW15.1 SW22.1 SW29.1 SW36.1
ROW2: ROW_MUX1.8(I1) SW2.1 SW9.1 SW16.1 SW23.1 SW30.1 SW37.1
ROW3: ROW_MUX1.7(I2) SW3.1 SW10.1 SW17.1 SW24.1 SW31.1 SW38.1
ROW4: ROW_MUX1.6(I3) SW4.1 SW11.1 SW18.1 SW25.1 SW32.1 SW39.1
ROW5: ROW_MUX1.4(I5) ROW_MUX1.5(I4) SW5.1 SW12.1 SW19.1 SW26.1 SW33.1 SW40.1
ROW6: ROW_MUX1.3(I6) SW6.1 SW13.1 SW20.1 SW27.1 SW34.1 SW41.1
ROW7: ROW_MUX1.2(I7) SW7.1 SW14.1 SW21.1 SW28.1 SW35.1 SW42.1
SCL: R68.1 R69.2 Screen1.3(Pin) U1.19
SDA: R68.2 Screen1.4(Pin) U1.18
TPWR: SW49.2 U1.VIN
VLED: C2.1 C7.2 C57.1 D1.1(VDD) D51.1(VDD) U6.2
VREF: R46.2 R47.2 U21.3(INA+) U21.5(INB+) U22.3(INA+) U22.5(INB+) U23.3(INA+) U23.5(INB+)
$1N66295: D35.2(DOUT) D36.4(DIN)
$1N66297: D15.2(DOUT) D16.4(DIN)
$1N66299: D26.3(VSS) D27.1(VDD)
$1N66303: D29.3(VSS) D30.1(VDD)
$1N66307: D4.3(VSS) D5.1(VDD)
$1N66319: D23.3(VSS) D24.1(VDD)
$1N66323: D3.3(VSS) D4.1(VDD)
$1N66327: D22.2(DOUT) D23.4(DIN)
$1N66329: C36.1 D36.3(VSS) D37.1(VDD)
$1N66333: D11.3(VSS) D12.1(VDD)
$1N66337: D31.3(VSS) D32.1(VDD)
$1N66341: C33.1 D18.3(VSS) D19.1(VDD)
$1N66348: D34.2(DOUT) D35.4(DIN)
$1N66350: D10.3(VSS) D11.1(VDD)
$1N66354: D20.3(VSS) D21.1(VDD)
$1N66358: D38.3(VSS) D39.1(VDD)
$1N66363: D17.3(VSS) D18.1(VDD)
$1N66367: D7.3(VSS) D8.1(VDD)
$1N66371: D9.3(VSS) D10.1(VDD)
$1N66375: D13.2(DOUT) D14.4(DIN)
$1N66377: D32.3(VSS) D33.1(VDD)
$1N66381: D15.3(VSS) D16.1(VDD)
$1N66385: D5.3(VSS) D6.1(VDD)
$1N66389: D19.2(DOUT) D20.4(DIN)
$1N66391: D20.2(DOUT) D21.4(DIN)
$1N66393: D35.3(VSS) D36.1(VDD)
$1N66399: C34.1 D24.3(VSS) D25.1(VDD)
$1N66403: D21.2(DOUT) D22.4(DIN)
$1N66405: D32.2(DOUT) D33.4(DIN)
$1N66411: D12.2(DOUT) D13.4(DIN)
$1N66413: C31.1 D6.3(VSS) D7.1(VDD)
$1N66418: D14.2(DOUT) D15.4(DIN)
$1N66420: D36.2(DOUT) D37.4(DIN)
$1N66422: D8.3(VSS) D9.1(VDD)
$1N66426: D40.3(VSS) D41.1(VDD)
$1N66431: D13.3(VSS) D14.1(VDD)
$1N66435: D7.2(DOUT) D8.4(DIN)
$1N66437: D33.3(VSS) D34.1(VDD)
$1N66441: D41.3(VSS) D42.1(VDD)
$1N66445: D25.3(VSS) D26.1(VDD)
$1N66449: C35.1 D30.3(VSS) D31.1(VDD)
$1N66453: D33.2(DOUT) D34.4(DIN)
$1N66455: D16.3(VSS) D17.1(VDD)
$1N66462: D21.3(VSS) D22.1(VDD)
$1N66466: D2.3(VSS) D3.1(VDD)
$1N66470: D1.3(VSS) D2.1(VDD)
$1N66474: D31.2(DOUT) D32.4(DIN)
$1N66476: D2.2(DOUT) D3.4(DIN)
$1N66478: D27.3(VSS) D28.1(VDD)
$1N66482: D34.3(VSS) D35.1(VDD)
$1N66486: D28.2(DOUT) D29.4(DIN)
$1N66488: D19.3(VSS) D20.1(VDD)
$1N66492: D17.2(DOUT) D18.4(DIN)
$1N66494: D25.2(DOUT) D26.4(DIN)
$1N66496: D37.3(VSS) D38.1(VDD)
$1N66500: D22.3(VSS) D23.1(VDD)
$1N66504: D39.3(VSS) D40.1(VDD)
$1N66508: D3.2(DOUT) D4.4(DIN)
$1N66510: D26.2(DOUT) D27.4(DIN)
$1N66512: C32.1 D12.3(VSS) D13.1(VDD)
$1N66516: D4.2(DOUT) D5.4(DIN)
$1N66518: D29.2(DOUT) D30.4(DIN)
$1N66520: D39.2(DOUT) D40.4(DIN)
$1N66522: D18.2(DOUT) D19.4(DIN)
$1N66524: D5.2(DOUT) D6.4(DIN)
$1N66528: D11.2(DOUT) D12.4(DIN)
$1N66530: D14.3(VSS) D15.1(VDD)
$1N66534: D23.2(DOUT) D24.4(DIN)
$1N66536: D30.2(DOUT) D31.4(DIN)
$1N66538: D27.2(DOUT) D28.4(DIN)
$1N66540: D28.3(VSS) D29.1(VDD)
$1N66544: D8.2(DOUT) D9.4(DIN)
$1N66546: D6.2(DOUT) D7.4(DIN)
$1N66548: D37.2(DOUT) D38.4(DIN)
$1N66550: D41.2(DOUT) D42.4(DIN)
$1N66552: D40.2(DOUT) D41.4(DIN)
$1N66554: D16.2(DOUT) D17.4(DIN)
$1N66556: D1.2(DOUT) D2.4(DIN)
$1N66558: D9.2(DOUT) D10.4(DIN)
$1N66560: D38.2(DOUT) D39.4(DIN)
$1N66562: D10.2(DOUT) D11.4(DIN)
$1N66564: D24.2(DOUT) D25.4(DIN)
$1N66632: J3.5 R19.1
$1N66634: J3.4 R4.1
$1N66635: D43.2(A) R21.1 U5.3(C2)
$1N66636: J2.5 R21.2
$1N66637: D43.1(K) J2.4 U5.2(C1)
$1N66700: C37.2 C38.2 R47.1 U1.3.3V_1
$1N66701: C37.1 C38.1 R46.1 U1.G2
$1N66704: LEDPWR1.2(A) U1.23
$1N66747: D51.2(DOUT) D52.4(DIN)
$1N66749: D52.2(DOUT) D53.4(DIN)
$1N66762: D51.3(VSS) D52.1(VDD)
$1N66766: D52.3(VSS) D53.1(VDD)
$1N66774: D54.2(DOUT) D55.4(DIN)
$1N66778: D55.2(DOUT) D56.4(DIN)
$1N66782: D56.2(DOUT) D57.4(DIN)
$1N66801: D59.4(DIN) D60.2(DOUT)
$1N66803: D58.4(DIN) D59.2(DOUT)
$2N8142: C11.2 R22.2 R23.2
$2N8143: C11.1 J4.1
$2N8144: D45.1(K) R23.1 U21.2(INA-)
$2N8145: D45.2(A) R24.1 R25.1 U21.1(OUTA)
$2N8148: C25.1 U21.4(VSS)
$2N8619: C39.2 R48.2 R49.2
$2N8620: C39.1 J5.1
$2N8621: D46.1(K) R49.1 U22.6(INB-)
$2N8622: D46.2(A) R50.1 R51.1 U22.7(OUTB)
$2N9096: C42.2 R52.2 R53.2
$2N9097: C42.1 J6.1
$2N9098: D47.1(K) R53.1 U21.6(INB-)
$2N9099: D47.2(A) R54.1 R55.1 U21.7(OUTB)
$2N9573: C45.2 R56.2 R57.2
$2N9574: C45.1 J7.1
$2N9575: D48.1(K) R57.1 U22.2(INA-)
$2N9576: D48.2(A) R58.1 R59.1 U22.1(OUTA)
$2N9579: C47.1 U22.4(VSS)
$2N9580: C47.2 U22.8(VDD)
$2N10050: C48.2 R60.2 R61.2
$2N10051: C48.1 J8.1
$2N10052: D49.1(K) R61.1 U23.2(INA-)
$2N10053: D49.2(A) R62.1 R63.1 U23.1(OUTA)
$2N10056: C50.1 U23.4(VSS)
$2N10057: C50.2 U23.8(VDD)
$2N10527: C51.2 R64.2 R65.2
$2N10528: C51.1 J9.1
$2N10529: D50.1(K) R65.1 U23.6(INB-)
$2N10530: D50.2(A) R66.1 R67.1 U23.7(OUTB)
$3N903: R20.1 U8.3(1Y)
Net-(C58-1): C58.1 D57.2(DOUT) D60.4(DIN)
Net-(D53-2): D53.2(DOUT) D54.4(DIN)
Net-(D53-3): D53.3(VSS) D54.1(VDD)
Net-(D54-3): D54.3(VSS) D55.1(VDD)
Net-(D55-3): D55.3(VSS) D56.1(VDD)
Net-(D56-3): D56.3(VSS) D57.1(VDD)
Net-(D57-3): D57.3(VSS) D60.1(VDD)
Net-(D58-1): D58.1(VDD) D59.3(VSS)
Net-(D59-1): D59.1(VDD) D60.3(VSS)

Not connected (* = marked no-connect by the designer): J2 1* 3* 6* 7*; J3 1* 3* 6* 7*; U1 12* 13* ON-OFF(ON/OFF)* PGM(PROGRAM)* VBAT*; U5 1(NC)* 4(NC)*

## Notes on the sheets
sheet 1
- INTERFACE & CONTROL
- MIDI
- CNTRL MATRIX
- MOADkNOBS-42 BUTTON
- 1
- LED MATRIX
- MOARkNOBS v2
- 12/03/25
- 5b
sheet 2
- EF FILTER
sheet 3
- POWER
- BUTTON MATRIX
- TEST PADS
